# Altium schematic sheet Quad-RS232-1.0-Blocos.SchDoc: Quad UART - Blocos
size A4; Revision: 1.0; SheetNumber: 1; SheetTotal: 4
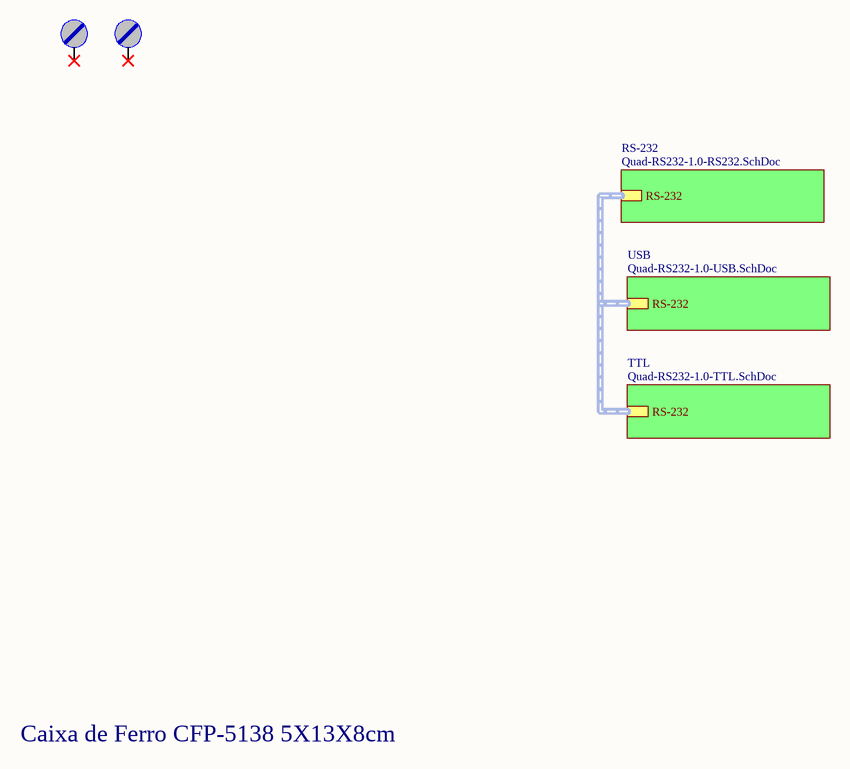
[diagram p0: Quad-RS232-1.0-Blocos.SchDoc]

## Parts
(Parts that share a designator on the sheet are numbered #1, #2 ... from top to bottom, then left to right.)
HOLE?#1  Furo de Fixação  [Furo_M3]  (value not drawn)  (no BOM)
HOLE?#2  Furo de Fixação  [Furo_M3]  (value not drawn)  (no BOM)

## Sub-sheets
RS-232 = Quad-RS232-1.0-RS232.SchDoc: RS-232 (harness RS-232)
TTL = Quad-RS232-1.0-TTL.SchDoc: RS-232 (harness RS-232)
USB = Quad-RS232-1.0-USB.SchDoc: RS-232 (harness RS-232)

## Nets

Not connected (* = marked no-connect by the designer): HOLE?#1 X*; HOLE?#2 X*

## Buses and harness runs
harness sheet RS-232/RS-232 = sheet TTL/RS-232 = sheet USB/RS-232

## Notes on the sheet
- Caixa de Ferro CFP-5138 5X13X8cm
- Projeto:
- Tamanho:
- Data:
- A4
- Eng. Felipe Navarro
- Hora:
- Revisão:
- Folha
- de
- Arquivo:

## Library data of the parts
HOLE?#1 HOLE?#2 = Parafuso: Furo para parafuso; Value: M3; ChinesePrice: 0,00000; Chinês: ----; Corrente: *; Potência: *; Supplier 1: Digi-Key; Supplier Part Number 1: --Del; Tensão: *; Obs:: *; Tolerância: *; ComponentLink1Description: Datasheet; ComponentLink1URL: D:\Tecnoclade\Datasheet\!DataMissing.pdf